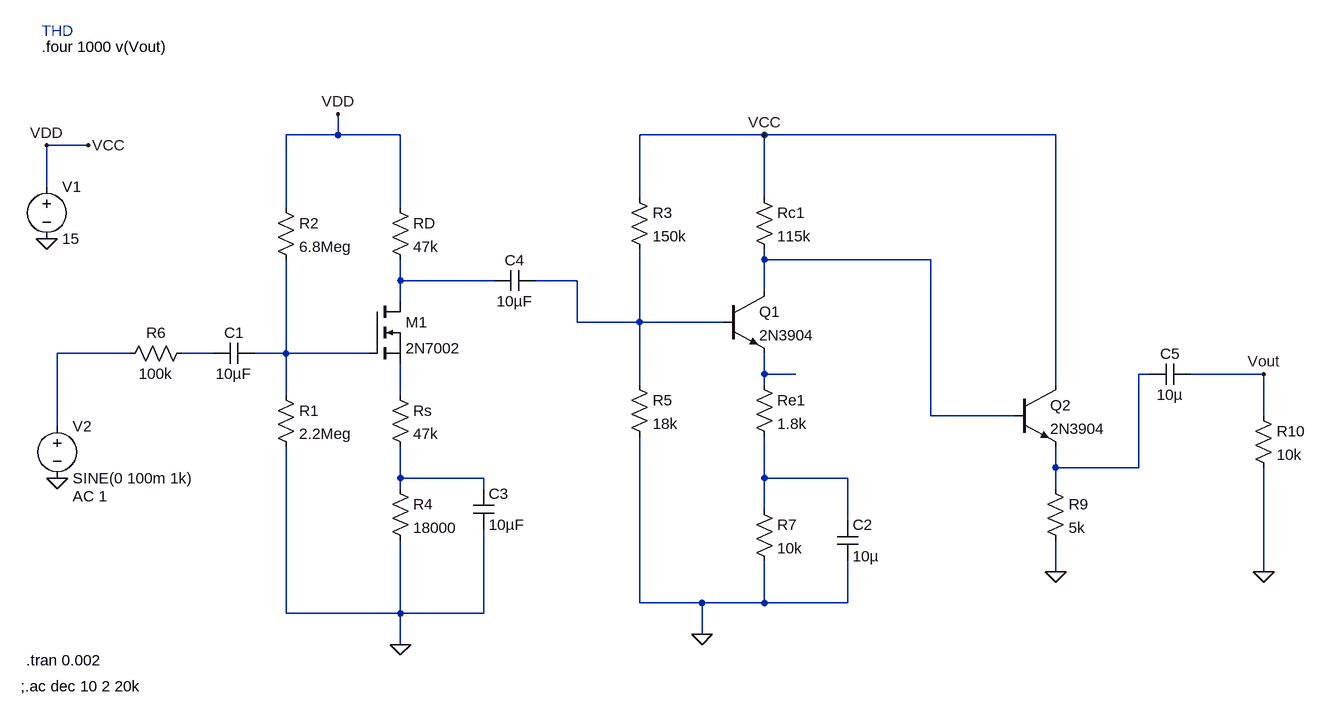
[diagram p0: schematic cs_nmos_amplifier.asc]
cs_nmos_amplifier.asc, the LTspice schematic file:
Version 4
SHEET 1 1828 704
WIRE 80 -160 80 -192
WIRE 80 -160 0 -160
WIRE 176 -160 80 -160
WIRE 736 -160 544 -160
WIRE 1184 -160 736 -160
WIRE -304 -144 -368 -144
WIRE -368 -80 -368 -144
WIRE 544 -64 544 -160
WIRE 736 -64 736 -160
WIRE 0 -48 0 -160
WIRE 176 -48 176 -160
WIRE 736 32 736 16
WIRE 992 32 736 32
WIRE 176 64 176 32
WIRE 320 64 176 64
WIRE 448 64 384 64
WIRE 736 80 736 32
WIRE 176 96 176 64
WIRE 448 128 448 64
WIRE 544 128 544 16
WIRE 544 128 448 128
WIRE 672 128 544 128
WIRE -240 176 -352 176
WIRE -112 176 -160 176
WIRE 0 176 0 32
WIRE 0 176 -48 176
WIRE 128 176 0 176
WIRE 736 208 736 176
WIRE 784 208 736 208
WIRE 1328 208 1312 208
WIRE 1504 208 1392 208
WIRE 544 224 544 128
WIRE 736 224 736 208
WIRE 1184 224 1184 -160
WIRE 0 240 0 176
WIRE 176 240 176 192
WIRE 992 272 992 32
WIRE 1120 272 992 272
WIRE 1504 272 1504 208
WIRE -352 288 -352 176
WIRE 1184 352 1184 320
WIRE 1312 352 1312 208
WIRE 1312 352 1184 352
WIRE 176 368 176 320
WIRE 304 368 176 368
WIRE 736 368 736 304
WIRE 864 368 736 368
WIRE 176 384 176 368
WIRE 304 384 304 368
WIRE 1184 384 1184 352
WIRE 736 416 736 368
WIRE 864 432 864 368
WIRE 1184 512 1184 464
WIRE 1504 512 1504 352
WIRE 544 560 544 304
WIRE 640 560 544 560
WIRE 736 560 736 496
WIRE 736 560 640 560
WIRE 864 560 864 496
WIRE 864 560 736 560
WIRE 0 576 0 320
WIRE 176 576 176 464
WIRE 176 576 0 576
WIRE 304 576 304 448
WIRE 304 576 176 576
WIRE 640 608 640 560
WIRE 176 624 176 576
FLAG -368 -144 VDD
FLAG -368 0 0
FLAG -352 368 0
FLAG 176 624 0
FLAG 80 -192 VDD
FLAG 1184 512 0
FLAG 1504 512 0
FLAG 1504 208 Vout
FLAG 736 -160 VCC
FLAG 640 608 0
FLAG -304 -144 VCC
DATAFLAG 0 176 ""
DATAFLAG 176 64 ""
DATAFLAG 176 224 ""
DATAFLAG 1264 352 ""
DATAFLAG 544 128 "round($*1000)/1000"
DATAFLAG 800 32 "round($*100)/100"
DATAFLAG 784 208 "round(1000*$)/1000"
DATAFLAG 544 -160 ""
DATAFLAG 864 288 "round(I(Re)*100000)/100000"
SYMBOL nmos 128 96 R0
SYMATTR InstName M1
SYMATTR Value 2N7002
SYMBOL res -16 224 R0
SYMATTR InstName R1
SYMATTR Value 2.2Meg
SYMBOL res -16 -64 R0
SYMATTR InstName R2
SYMATTR Value 6.8Meg
SYMBOL res 160 -64 R0
SYMATTR InstName RD
SYMATTR Value 47k
SYMBOL res 160 224 R0
SYMATTR InstName Rs
SYMATTR Value 47k
SYMBOL res -144 160 R90
WINDOW 0 0 56 VBottom 2
WINDOW 3 32 56 VTop 2
SYMATTR InstName R6
SYMATTR Value 100k
SYMBOL cap -48 160 R90
WINDOW 0 0 32 VBottom 2
WINDOW 3 32 32 VTop 2
SYMATTR InstName C1
SYMATTR Value 10µF
SYMBOL voltage -368 -96 R0
WINDOW 123 0 0 Left 0
WINDOW 39 0 0 Left 0
SYMATTR InstName V1
SYMATTR Value 15
SYMBOL voltage -352 272 R0
WINDOW 123 24 124 Left 2
WINDOW 39 0 0 Left 0
SYMATTR Value2 AC 1
SYMATTR InstName V2
SYMATTR Value SINE(0 100m 1k)
SYMBOL res 160 368 R0
SYMATTR InstName R4
SYMATTR Value 18000
SYMBOL cap 288 384 R0
SYMATTR InstName C3
SYMATTR Value 10µF
SYMBOL npn 1120 224 R0
SYMATTR InstName Q2
SYMATTR Value 2N3904
SYMBOL res 1168 368 R0
SYMATTR InstName R9
SYMATTR Value 5k
SYMBOL res 1488 256 R0
SYMATTR InstName R10
SYMATTR Value 10k
SYMBOL cap 1392 192 R90
WINDOW 0 0 32 VBottom 2
WINDOW 3 32 32 VTop 2
SYMATTR InstName C5
SYMATTR Value 10µ
SYMBOL npn 672 80 R0
SYMATTR InstName Q1
SYMATTR Value 2N3904
SYMBOL res 528 -80 R0
SYMATTR InstName R3
SYMATTR Value 150k
SYMBOL res 528 208 R0
SYMATTR InstName R5
SYMATTR Value 18k
SYMBOL res 720 -80 R0
SYMATTR InstName Rc1
SYMATTR Value 115k
SYMBOL res 720 208 R0
SYMATTR InstName Re1
SYMATTR Value 1.8k
SYMBOL res 720 400 R0
SYMATTR InstName R7
SYMATTR Value 10k
SYMBOL cap 848 432 R0
SYMATTR InstName C2
SYMATTR Value 10µ
SYMBOL cap 384 48 R90
WINDOW 0 0 32 VBottom 2
WINDOW 3 32 32 VTop 2
SYMATTR InstName C4
SYMATTR Value 10µF
TEXT -400 648 Left 2 !.tran 0.002
TEXT -376 -296 Left 2 !.four 1000 v(Vout)
TEXT -376 -320 Left 2 ;THD
TEXT -408 688 Left 2 !;.ac dec 10 2 20k

The netlist it stands for:
* cs_nmos_amplifier.asc
M1 N002 N006 N009 N009 2N7002
R1 N006 0 2.2Meg
R2 VCC N006 6.8Meg
RD VCC N002 47k
Rs N009 N010 47k
R6 N005 N004 100k
C1 N006 N005 10µF
V1 VCC 0 15
V2 N004 0 SINE(0 100m 1k) AC 1
R4 N010 0 18000
C3 N010 0 10µF
Q2 VCC N001 N008 0 2N3904
R9 N008 0 5k
R10 Vout 0 10k
C5 Vout N008 10µ
Q1 N001 N003 N007 0 2N3904
R3 VCC N003 150k
R5 N003 0 18k
Rc1 VCC N001 115k
Re1 N007 N011 1.8k
R7 N011 0 10k
C2 N011 0 10µ
C4 N003 N002 10µF
.model NPN NPN
.model PNP PNP
.lib standard.bjt
.model NMOS NMOS
.model PMOS PMOS
.lib standard.mos
.tran 0.002
.four 1000 v(Vout)
* THD
;.ac dec 10 2 20k
.backanno
.end